# EAGLE design microreg-sch (EAGLE 7.6.0)
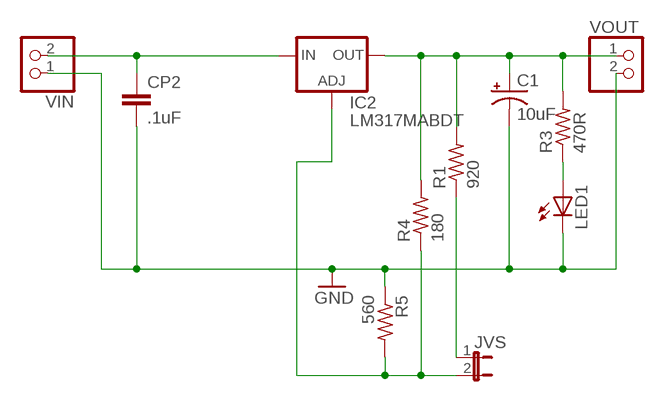
[diagram p0: schematic, sheet 1]

## Parts
C1  10uF  CPOL-USE2.5-5  [E2,5-5]
CP2  .1uF  C-EUC1206  [C1206]
IC2  LM317MABDT  [DPACK]
JVS  JP1E  [JP1]
LED1  LEDCHIPLED_1206  [CHIPLED_1206]
R1  920  R-US_R1206  [R1206]
R3  470R  R-US_M1206  [M1206]
R4  180  R-US_M1206  [M1206]
R5  560  R-US_M1206  [M1206]
VIN  PINHD-1X2  [1X02]
VOUT  PINHD-1X2  [1X02]

## Nets
GND: C1.- CP2.2 LED1.C R5.1 VIN.1 VOUT.2
N$1: CP2.1 IC2.3(IN) VIN.2
N$2: JVS.1 R1.1
N$3: IC2.1(ADJ) JVS.2 R4.1 R5.2
N$4: LED1.A R3.1
N$5: C1.+ IC2.4(OUT) R1.2 R3.2 R4.2 VOUT.1

## Library data of the parts
C1 = rcl:CPOL-US: POLARIZED CAPACITOR, American symbol
CP2 = rcl:C-EU: CAPACITOR, European symbol
IC2 = v-reg:LM317?*: 500 mA Adjustable Output Positive Voltage Regulator Source: http://www.onsemi.co.jp .. LM317M-D.PDF
JVS = jumper:JP1E: JUMPER
LED1 = led:LED: LED OSRAM: - CHIPLED LG R971, LG N971, LY N971, LG Q971, LY Q971, LO R971, LY R971 LH N974, LH R974 LS Q976, LO Q976, LY Q976 LO Q996 - Hyper CHIPLED LW Q18S LB Q993, LB Q99A, LB R99A - SideLED LS A670, LO A670, LY A670, LG A670, LP A670 LB A673, LV A673, LT A673, LW A673 LH A674 LY A675 LS A676, LA A676, LO A676, LY A676, LW A676 LS A679, LY A679, LG A679 - Hyper Micro SIDELED® LS Y876, LA Y876, LO Y876, LY Y876 LT Y87S - SmartLED LW L88C, LW L88S LB L89C, LB L89S, LG L890 LS L89K, LO L89K, LY L89K LS L896, LA L896, LO L896, LY L896 - TOPLED LS T670, LO T670, LY T670, LG T670, LP T670 LSG T670, LSP T670, LSY T670, LOP T670, LYG T670 LG T671, LOG T671, LSG T671 LB T673, LV T673, LT T673, LW T673 LH T674 LS T676, LA T676, LO T676, LY T676, LB T676, LH T676, LSB T676, LW T676 LB T67C, LV T67C, LT T67C, LS T67K, LO T67K, LY T67K, LW E67C LS E67B, LA E67B, LO E67B, LY E67B, LB E67C, LV E67C, LT E67C LW T67C LS T679, LY T679, LG T679 LS T770, LO T770, LY T770, LG T770, LP T770 LB T773, LV T773, LT T773, LW T773 LH T774 LS E675, LA E675, LY E675, LS T675 LS T776, LA T776, LO T776, LY T776, LB T776 LHGB T686 LT T68C, LB T68C - Hyper Mini TOPLED® LB M676 - Mini TOPLED Santana® LG M470 LS M47K, LO M47K, LY M47K Source: http://www.osram.convergy.de LUXEON: - LUMILED® LXK2-PW12-R00, LXK2-PW12-S00, LXK2-PW14-U00, LXK2-PW14-V00 LXK2-PM12-R00, LXK2-PM12-S00, LXK2-PM14-U00 LXK2-PE12-Q00, LXK2-PE12-R00, LXK2-PE12-S00, LXK2-PE14-T00, LXK2-PE14-U00 LXK2-PB12-K00, LXK2-PB12-L00, LXK2-PB12-M00, LXK2-PB14-N00, LXK2-PB14-P00, LXK2-PB14-Q00 LXK2-PR12-L00, LXK2-PR12-M00, LXK2-PR14-Q00, LXK2-PR14-R00 LXK2-PD12-Q00, LXK2-PD12-R00, LXK2-PD12-S00 LXK2-PH12-R00, LXK2-PH12-S00 LXK2-PL12-P00, LXK2-PL12-Q00, LXK2-PL12-R00 Source: www.luxeon.com KINGBRIGHT: KA-3528ASYC Source: www.kingbright.com
R1 R3-R5 = rcl:R-US_: RESISTOR, American symbol
VIN VOUT = pinhead:PINHD-1X2: PIN HEADER

## Board
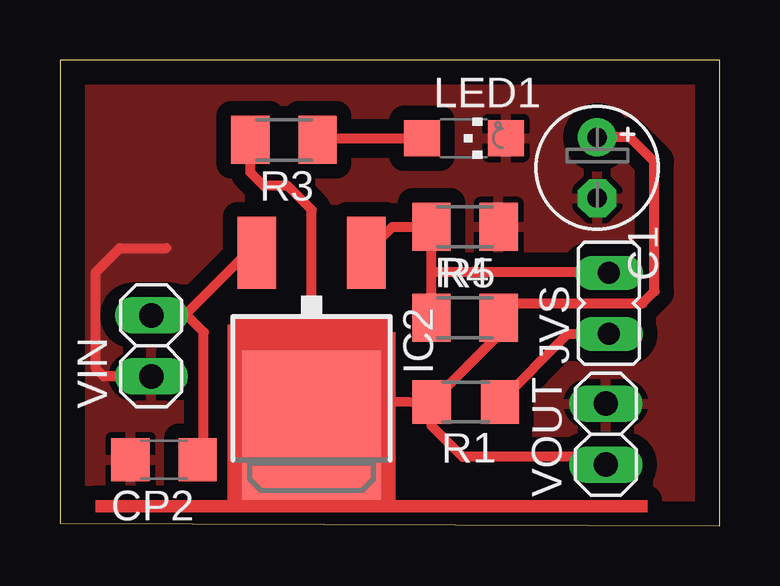
[diagram p1: board, top side]

Size 27.52 x 19.4 mm. Coordinates in mm from the lower left corner, seen from the top.
Outline: 0,0.1 27.52,0 27.52,19.4 0,19.4 0,0.1
Copper layers (1*16): Top 0.035mm / dielectric 1.5mm / Bottom 0.035mm
Design rules "default": minimum track width 10mil, minimum drill 24mil, track to track 8mil, track to pad 8mil, pad to pad 8mil, via to via 8mil, smd to smd 8mil, copper to edge 40mil, drill to drill 8mil, minimum pad ring 10mil, minimum via ring 8mil, stop-mask expansion 4mil, vias tented up to drill 0mil, thermal gap 10mil

### Footprints (pad centres in the part's own frame; a part is rotated, then mirrored left to right if it is on the bottom)
E2,5-5 = drill 0.813 pad 1.6: + -1.27,0 | drill 0.813 pad 1.6 octagon: - 1.27,0
C1206 = smd 1.6 x 1.8: 1 -1.4,0; 2 1.4,0
DPACK = smd 1.6 x 3: 1 -2.28,-4.8; 3 2.28,-4.8 | smd 5.8 x 6.2: 4 0,2.38
JP1 = drill 0.914 long: 1 0,-1.27; 2 0,1.27
CHIPLED_1206 = smd 1.5 x 1.5: A 0,-1.75; C 0,1.75
R1206 = smd 1.6 x 1.803: 1 -1.422,0; 2 1.422,0
M1206 = smd 1.6 x 2: 1 -1.4,0; 2 1.4,0
1X02 = drill 1.016 long: 1 -1.27,0; 2 1.27,0

### Placement (x,y rotation side)
C1  22.4,14.91 270 top
CP2  4.34,2.74 180 top
IC2  10.49,6.56 180 top
JVS  22.89,9.26 0 top
LED1  16.84,16.14 270 top
R1  16.92,5.15 180 top
R3  9.34,16.07 180 top
R4  16.89,8.66 0 top
R5  16.89,12.45 180 top
VIN  3.81,7.49 90 top
VOUT  22.76,3.81 90 top

### Tracks (layer width: path | path; a pad name or v marks a point on that pad's centre or on a via)
GND
  Top 0.406: VIN.1 1.83,6.22 1.49,6.56 1.49,10.56 2.49,11.56 4.44,11.56
  pour Top (isolate 0.61): 0.09,19.26 27.29,19.26 27.29,0.26 0.09,0.26 0.09,19.16
N$1
  Top 0.406: CP2.1 5.99,2.74 5.99,8.06 5.29,8.76 VIN.2 5.19,8.76 7.49,11.06 7.91,11.06 IC2.3
N$2
  Top 0.406: R1.1 21.18,7.99 JVS.1
N$3
  Top 0.406: 15.49,11.72 R5.2 | IC2.1 13.86,12.45 R5.2 | R4.1 15.49,10.56 | 15.49,10.56 R5.2 | JVS.2 22.86,10.56 15.49,10.56
N$4
  Top 0.406: R3.1 10.71,16.14 LED1.A
N$5
  Top 0.406: IC2.4 11.16,5.25 | 11.16,5.25 R1.2 | R1.2 18.19,7.84 R4.2 18.79,9.26 24.29,9.26 24.79,9.76 24.79,15.16 23.77,16.18 C1.+ | VOUT.1 22.44,2.86 16.79,2.86 15.5,4.15 R1.2 | 11.16,5.25 10.49,5.92 10.49,13.16 9.49,14.16 8.49,14.16 7.94,14.71 R3.2
(copper drawn outside any net)
  shapes: Top area x5